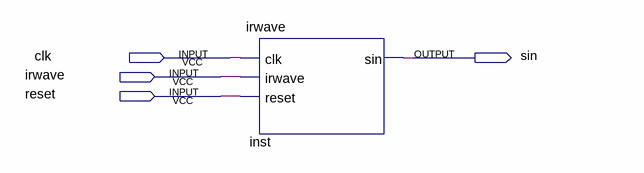
[diagram p0: schematic sheet]
// Quartus schematic irwave_test.bdf as structural Verilog: 1 symbols, 4 pins
module irwave_test (
  input  clk,
  input  irwave,
  input  reset,
  output sin
);

  irwave inst (.clk(clk), .irwave(irwave), .reset(reset), .sin(sin));
endmodule
